# Altium schematic sheet 2_RFD900x.SchDoc
size A4
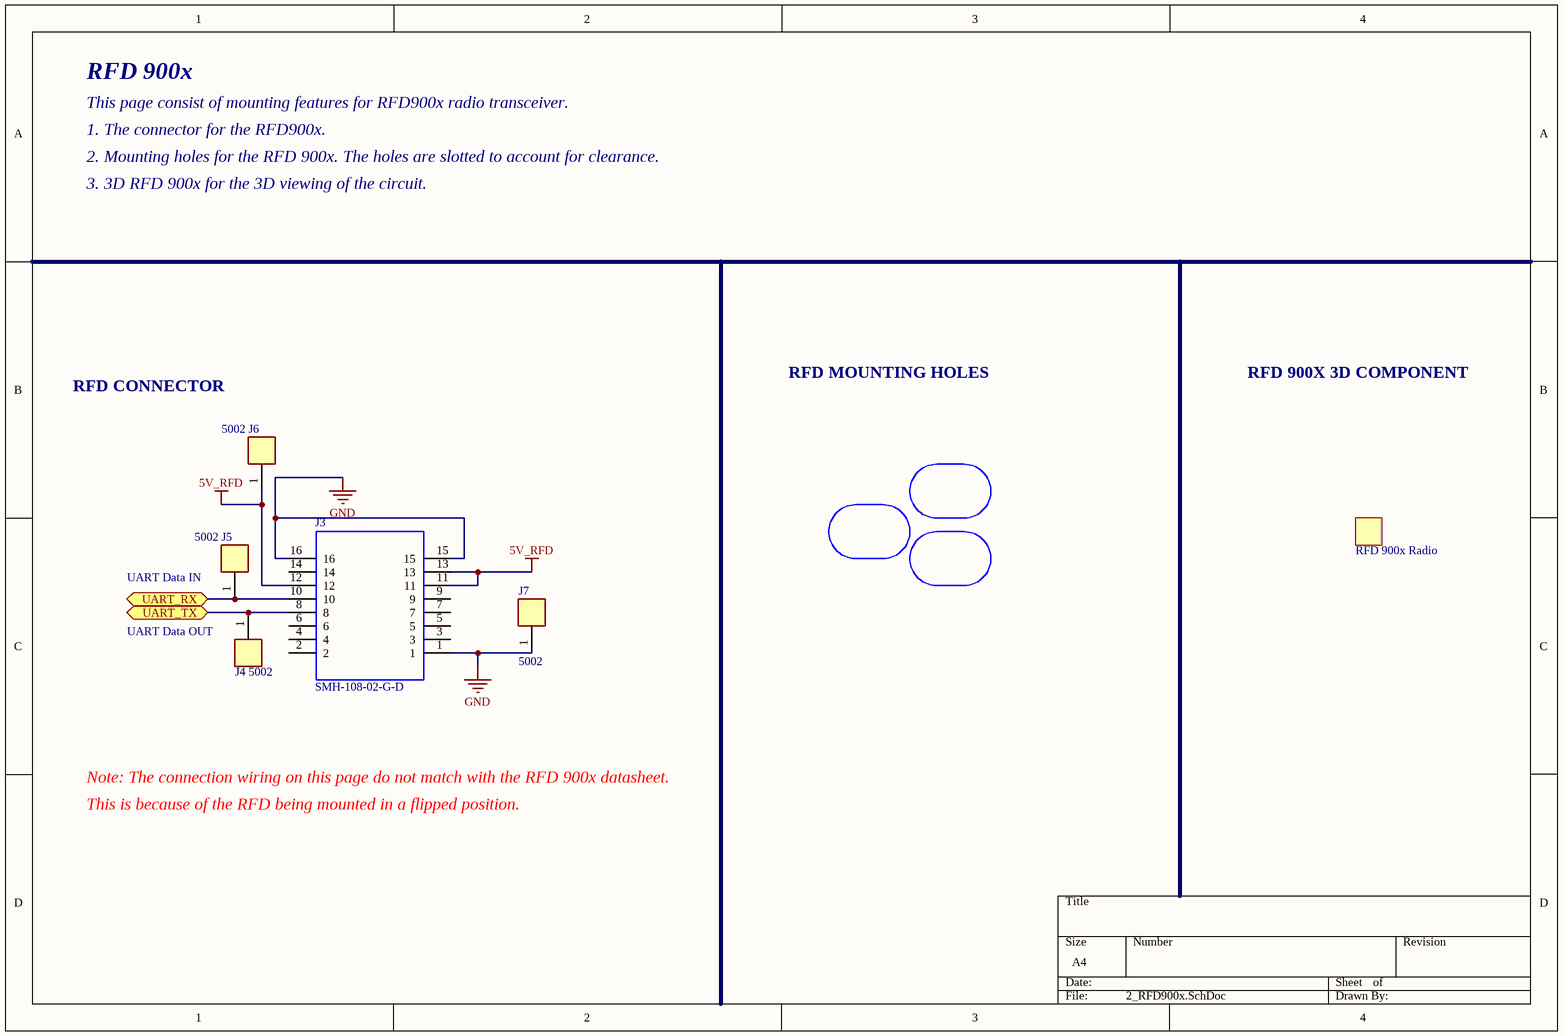
[diagram p0: 2_RFD900x.SchDoc]

## Parts
*  RFD 900x Radio  [RFD900X]  (no BOM)
H5  M3 not plated slotted  [M3 not plated - slotted]  (value not drawn)
H6  M3 not plated slotted  [M3 not plated - slotted]  (value not drawn)
H7  M3 not plated slotted  [M3 not plated - slotted]  (value not drawn)
J3  SMH-108-02-G-D  [SAMTEC_SMH-108-02-G-D]
J4  5002  [KEYSTONE_5002]
J5  5002  [KEYSTONE_5002]
J6  5002  [KEYSTONE_5002]
J7  5002  [KEYSTONE_5002]

## Ports
UART_RX, UART_TX

## Nets
5V_RFD: J3.11 J3.12 J3.13 J6.1
GND: J3.1 J3.15 J3.16 J7.1
UART_RX: J3.10 J5.1 ; port UART_RX
UART_TX: J3.8 J4.1 ; port UART_TX

Not connected (* = marked no-connect by the designer): J3 2 3 4 5 6 7 9 14

## Notes on the sheet
- RFD 900x
- This page consist of mounting features for RFD900x radio transceiver.
- 1. The connector for the RFD900x.
- 2. Mounting holes for the RFD 900x. The holes are slotted to account for clearance.
- 3. 3D RFD 900x for the 3D viewing of the circuit.
- RFD MOUNTING HOLES
- RFD 900X 3D COMPONENT
- RFD CONNECTOR
- (near J5) UART Data IN
- UART Data OUT
- Note: The connection wiring on this page do not match with the RFD 900x datasheet.
- This is because of the RFD being mounted in a flipped position.

## Library data of the parts
H5-H7 = M3 not plated slotted: M3 hole not plated slotted
J3 = SMH-108-02-G-D: SAMTEC 16POS 0.1"pitch; PartNumber: SAM11816-ND; Value: 0.1 inch pitch header; Package: *; Link: https://www.digikey.ca/en/products/detail/samtec-inc/SMH-108-02-G-D/6693456; SupplierPartNumber: SMH-108-02-G-D; SuppliersPartNumber: *
J4-J7 = 5002: Test Point Ring Keystone; Manufacturer: Keystone Electronics; Value: Test Point Keystone Electronics; Package: *; PartNumber: 5002; SupplierNumber: 36-5002-ND; SuppliersPartNumber: C238123; Link: https://www.digikey.ca/en/products/detail/keystone-electronics/5002/255328